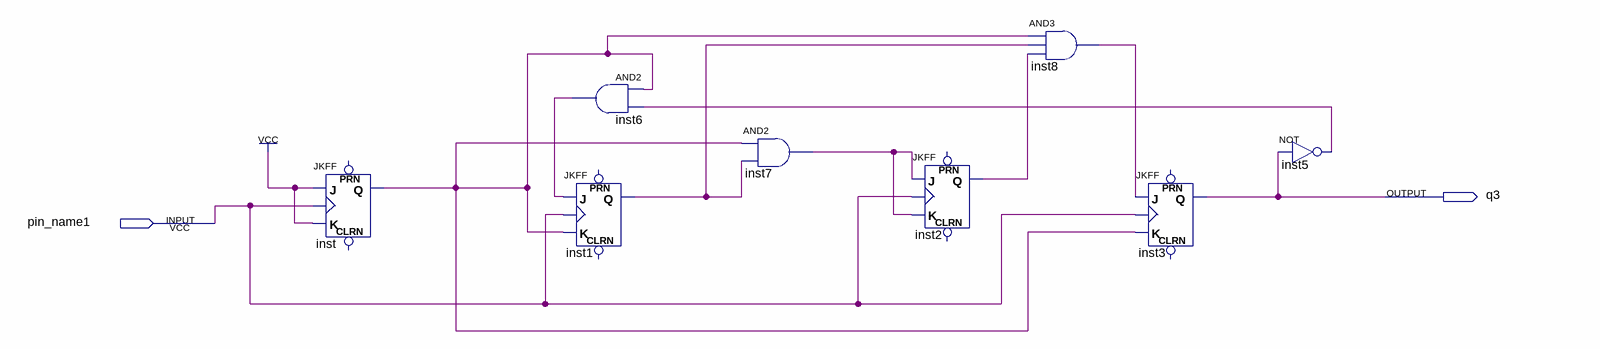
[diagram p0: schematic sheet]
// Quartus schematic div10.bdf as structural Verilog: 8 symbols, 2 pins
module div10 (
  input  pin_name1,
  output q3
);

  wire inst1_q, inst2_q, inst5_out, inst6_out, inst7_out, inst8_out, inst_q;

  JKFF inst (.K(1'b1), .J(1'b1), .CLK(pin_name1), .Q(inst_q));  // open: PRN, CLRN
  and inst6 (inst6_out, inst_q, inst5_out);
  JKFF inst1 (.K(inst_q), .J(inst6_out), .CLK(pin_name1), .Q(inst1_q));  // open: PRN, CLRN
  and inst7 (inst7_out, inst_q, inst1_q);
  JKFF inst2 (.K(inst7_out), .J(inst7_out), .CLK(pin_name1), .Q(inst2_q));  // open: PRN, CLRN
  and inst8 (inst8_out, inst_q, inst1_q, inst2_q);
  JKFF inst3 (.K(inst_q), .J(inst8_out), .CLK(pin_name1), .Q(q3));  // open: PRN, CLRN
  not inst5 (inst5_out, q3);
endmodule
